# EasyEDA Pro project USB Hub PCB.epro

# Schematic Schematic1
Board Name: Board1; Create Date: 2026-05-19; Page Name: P1; Project Name: USB Hub; Schematic Name: Schematic1; Update Date: 2026-05-19; Company: EasyEDA.com; Page Size: A4; Version: V1.0
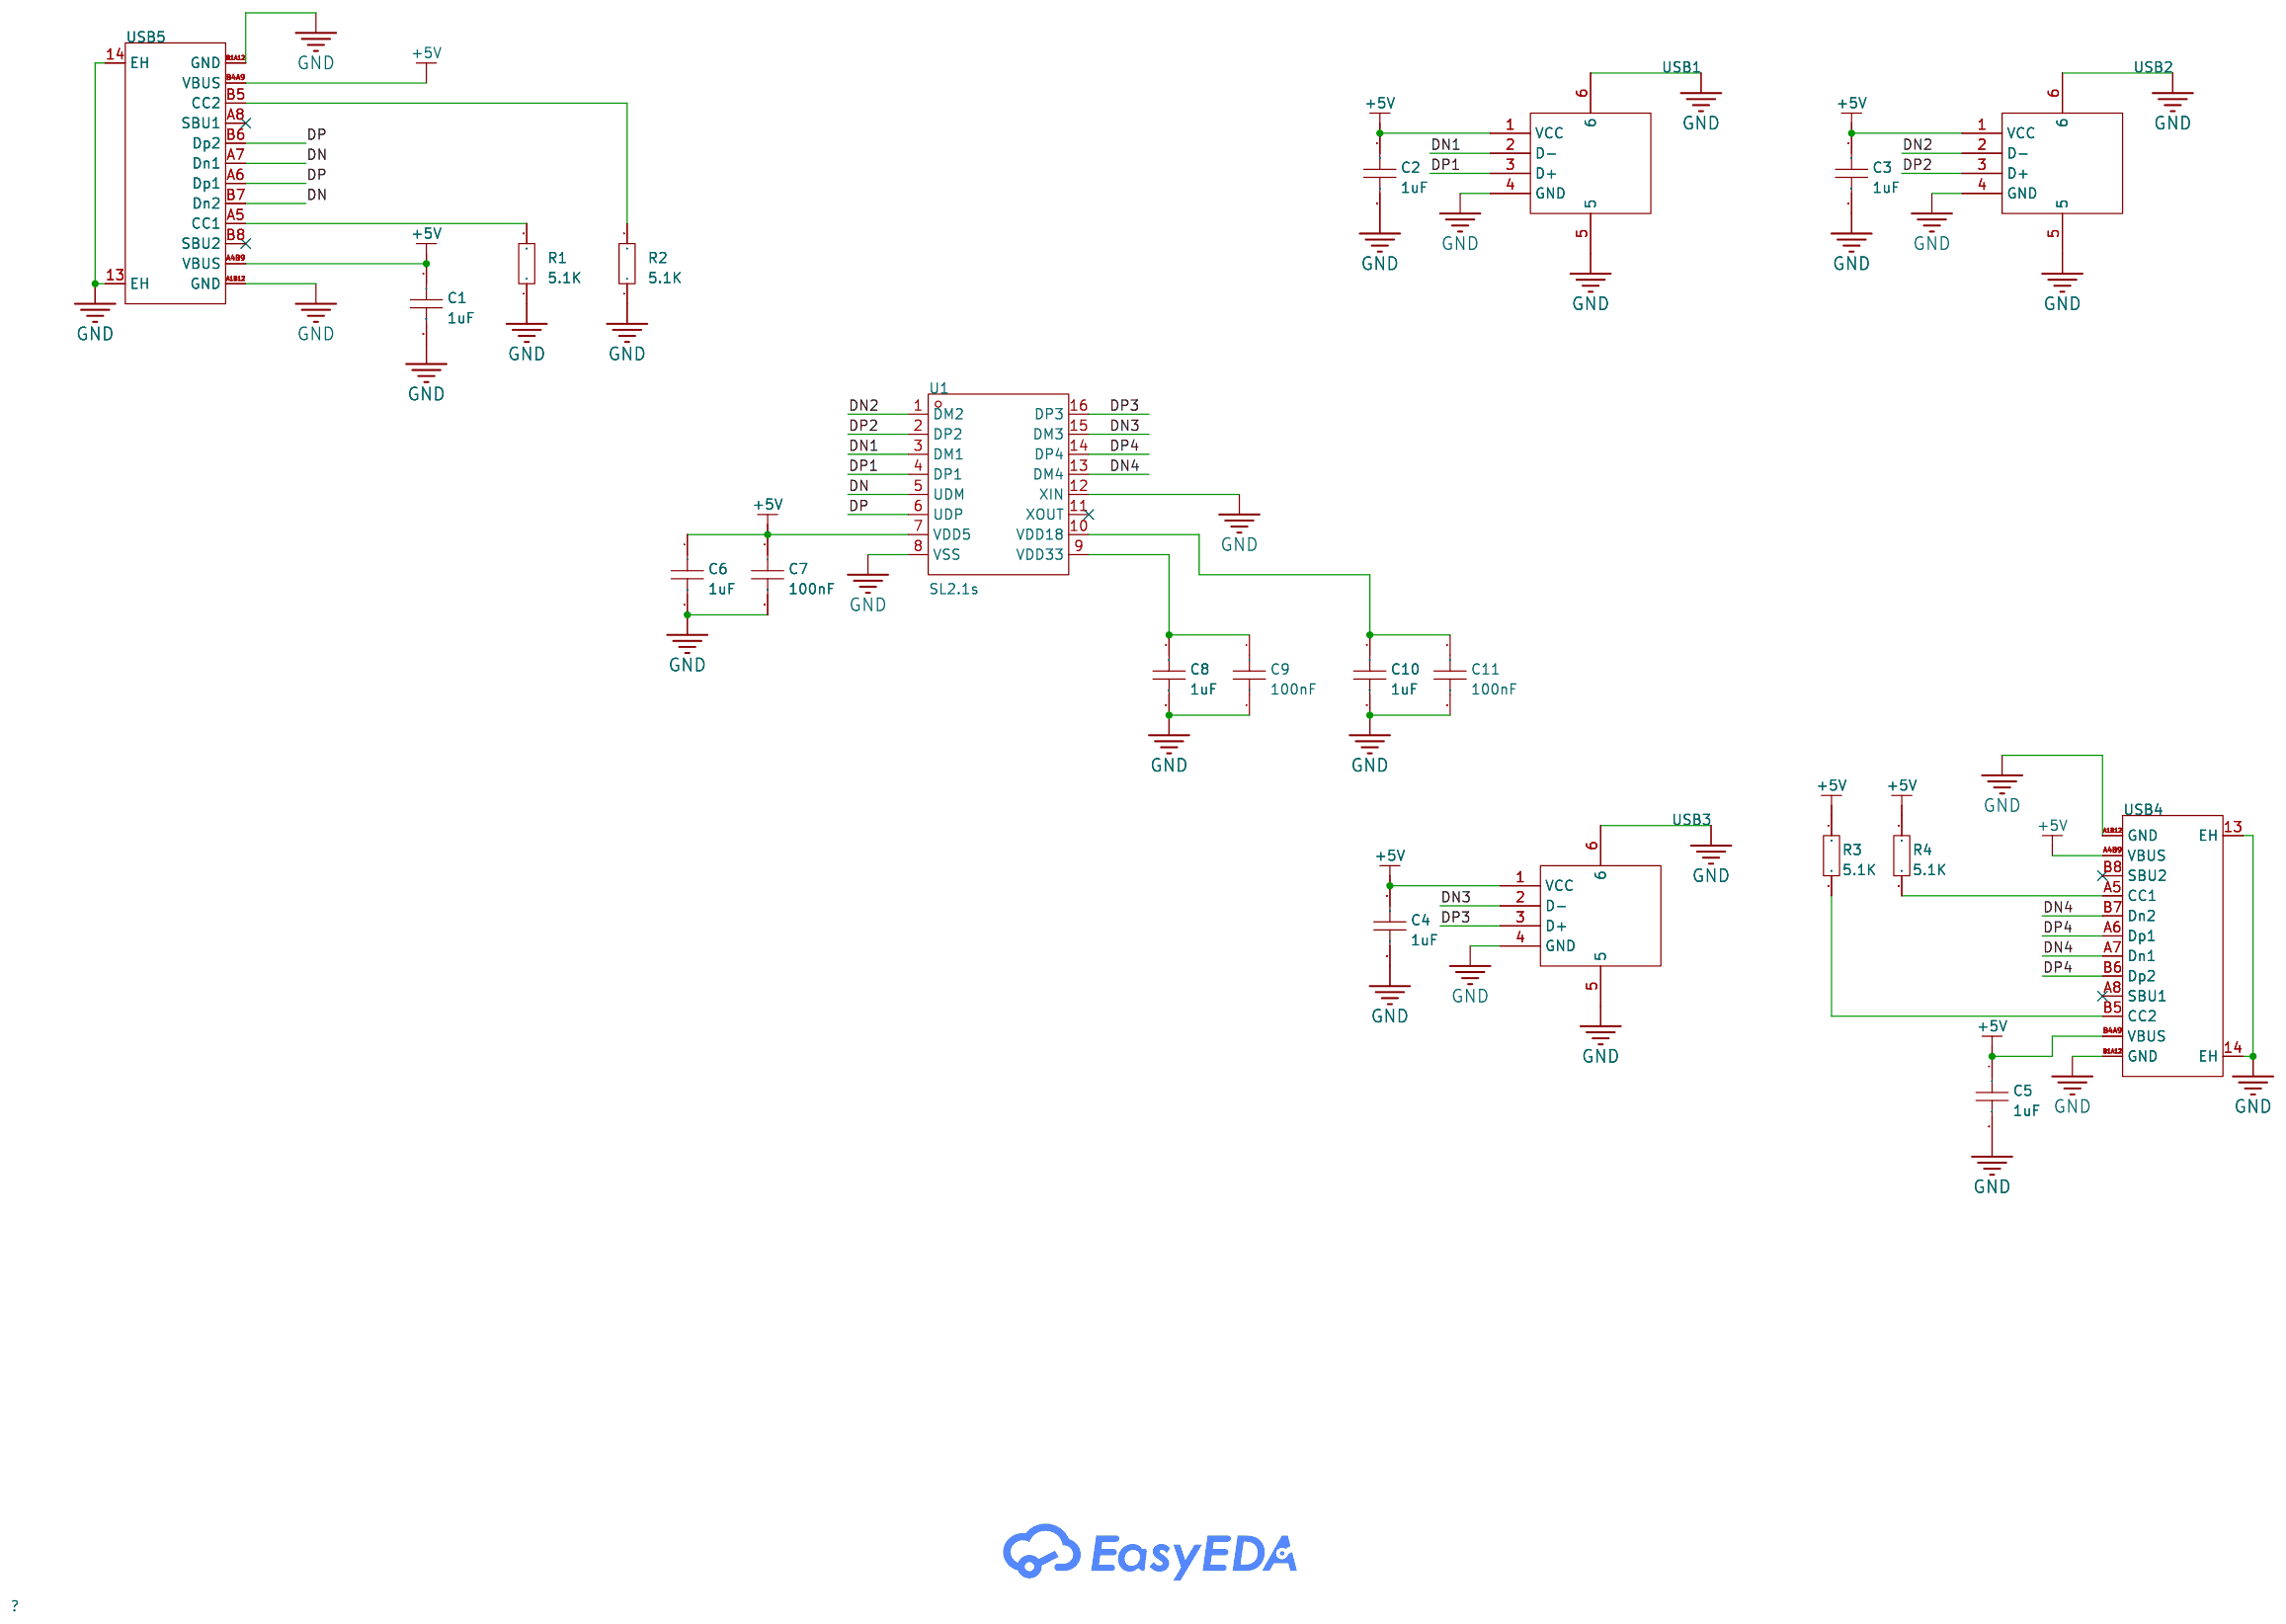
[diagram p0: schematic sheet]

## Parts
C1  1uF  [C0603]
C2  1uF  [C0603]
C3  1uF  [C0603]
C4  1uF  [C0603]
C5  1uF  [C0603]
C6  1uF  [C0603]
C7  100nF  [C0603]
C8  1uF  [C0603]
C9  100nF  [C0603]
C10  1uF  [C0603]
C11  100nF  [C0603]
R1  5.1K  [R0603]
R2  5.1K  [R0603]
R3  5.1K  [R0603]
R4  5.1K  [R0603]
U1  SL2.1s  [SSOP-16_L4.6-W2.6-P0.53-LS4.0-BL]
USB1  10.0 QHHTZB6.3  [USB-A-TH_10.0QHHTZB6.3]
USB2  10.0 QHHTZB6.3  [USB-A-TH_10.0QHHTZB6.3]
USB3  10.0 QHHTZB6.3  [USB-A-TH_10.0QHHTZB6.3]
USB4  TYPE-C 16PIN 2MD(073)  [USB-C-SMD_TYPE-C-16PIN-2MD-073]
USB5  TYPE-C 16PIN 2MD(073)  [USB-C-SMD_TYPE-C-16PIN-2MD-073]

## Library data of the parts
C1-C11 = CAP_0603: Supplier Footprint: 0603
R1-R4 = Res_0603: Supplier Footprint: 0603
U1 = SL2.1s: type:Hub USB Protocol:USB 2.0 Data Rate:- Voltage - Supply:4V~5.25V Voltage - Supply:4V~5.25V Operating Temperature:0℃~+70℃ Operating Temperature:0℃~+70℃ Memory Interface:- Current - Supply:120mA Quiescent Supply Current:2.5mA Number of Channels:4; LCSC Part Name: USB2.0 HUB控制器集成电路; Supplier Part: C2684433; Manufacturer: CoreChips(和芯润德); Supplier Footprint: SSOP-16; JLCPCB Part Class: Extended Part; Datasheet: https://item.szlcsc.com/datasheet/SL2.1s/2782346.html; Supplier: LCSC; type: Hub; USB Protocol: USB 2.0; Voltage - Supply: 4V~5.25V; Operating Temperature: 0℃~+70℃; Current - Supply: 120mA; Quiescent Supply Current: 2.5mA; Number of Channels: 4
USB1-USB3 = 10.0 QHHTZB6.3: Connector Type:Type-A Protocol Standard:USB 2.0 Gender:Female Mounting Type:Surface Mount, Right Angle Number of Contacts:4P Number of Ports:1 Current Rating-Power:1.5A Voltage Rating:30V Connect-Disconnect Life:5,000 times Supplementary Features:- Center; LCSC Part Name: 壳长10.0mm; Supplier Part: C668591; Manufacturer: SHOU HAN(首韩); Supplier Footprint: SMD; JLCPCB Part Class: Extended Part; Datasheet: https://item.szlcsc.com/datasheet/10.0%2520QHHTZB6.3/698534.html; Supplier: LCSC; Connector Type: Type-A; Protocol Standard: USB 2.0; Gender: Female; Mounting Type: Surface Mount, Right Angle; Number of Contacts: 4P; Number of Ports: 1; Current Rating-Power: 1.5A; Voltage Rating: 30V; Connect-Disconnect Life: 5,000 times; Length: 10mm; Detection color: Black; Operating Temperature: -25℃~+85℃
USB4 USB5 = TYPE-C 16PIN 2MD(073): Connector Type:Type-C Protocol Standard:- Gender:Female Mounting Type:Surface Mount, Right Angle Number of Contacts:16P Number of Ports:1 Current Rating-Power:3A Voltage Rating:5V Connect-Disconnect Life:10,000 Cycles Supplementary Features:- Center Heigh; LCSC Part Name: Type-C 母 卧贴; Supplier Part: C2765186; Manufacturer: SHOU HAN(首韩); Supplier Footprint: SMD; JLCPCB Part Class: Extended Part; Datasheet: https://item.szlcsc.com/datasheet/TYPE-C%252016PIN%25202MD(073)/2901843.html; Supplier: LCSC; Connector Type: Type-C; Gender: Female; Mounting Type: Surface Mount, Right Angle; Number of Contacts: 16P; Number of Ports: 1; Current Rating-Power: 3A; Voltage Rating: 5V; Connect-Disconnect Life: 10,000 Cycles; Detection color: Black; Operating Temperature: -25℃~+85℃

## Nets
+5V: C1.1 C2.1 C3.1 C4.1 C5.1 C6.1 C7.1 R3.1 R4.1 U1.7(VDD5) USB1.1(VCC) USB2.1(VCC) USB3.1(VCC) USB4.A4B9(VBUS) USB4.B4A9(VBUS) USB5.A4B9(VBUS) USB5.B4A9(VBUS)
GND: C1.2 C2.2 C3.2 C4.2 C5.2 C6.2 C7.2 C8.2 C9.2 C10.2 C11.2 R1.1 R2.1 U1.8(VSS) U1.12(XIN) USB1.4(GND) USB1.5 USB1.6 USB2.4(GND) USB2.5 USB2.6 USB3.4(GND) USB3.5 USB3.6 USB4.13(EH) USB4.14(EH) USB4.A1B12(GND) USB4.B1A12(GND) USB5.13(EH) USB5.14(EH) USB5.A1B12(GND) USB5.B1A12(GND)
DN: U1.5(UDM) USB5.A7(Dn1) USB5.B7(Dn2)
DN1: U1.3(DM1) USB1.2(D-)
DN2: U1.1(DM2) USB2.2(D-)
DN3: U1.15(DM3) USB3.2(D-)
DN4: U1.13(DM4) USB4.A7(Dn1) USB4.B7(Dn2)
DP: U1.6(UDP) USB5.A6(Dp1) USB5.B6(Dp2)
DP1: U1.4(DP1) USB1.3(D+)
DP2: U1.2(DP2) USB2.3(D+)
DP3: U1.16(DP3) USB3.3(D+)
DP4: U1.14(DP4) USB4.A6(Dp1) USB4.B6(Dp2)
$1N939: R1.2 USB5.A5(CC1)
$1N943: R2.2 USB5.B5(CC2)
$1N1533: R4.2 USB4.A5(CC1)
$1N1537: R3.2 USB4.B5(CC2)
$1N2153: C8.1 C9.1 U1.9(VDD33)
$1N2172: C10.1 C11.1 U1.10(VDD18)

Not connected (* = marked no-connect by the designer): U1 11(XOUT)*; USB4 A8(SBU1)* B8(SBU2)*; USB5 A8(SBU1)* B8(SBU2)*

# Board PCB1
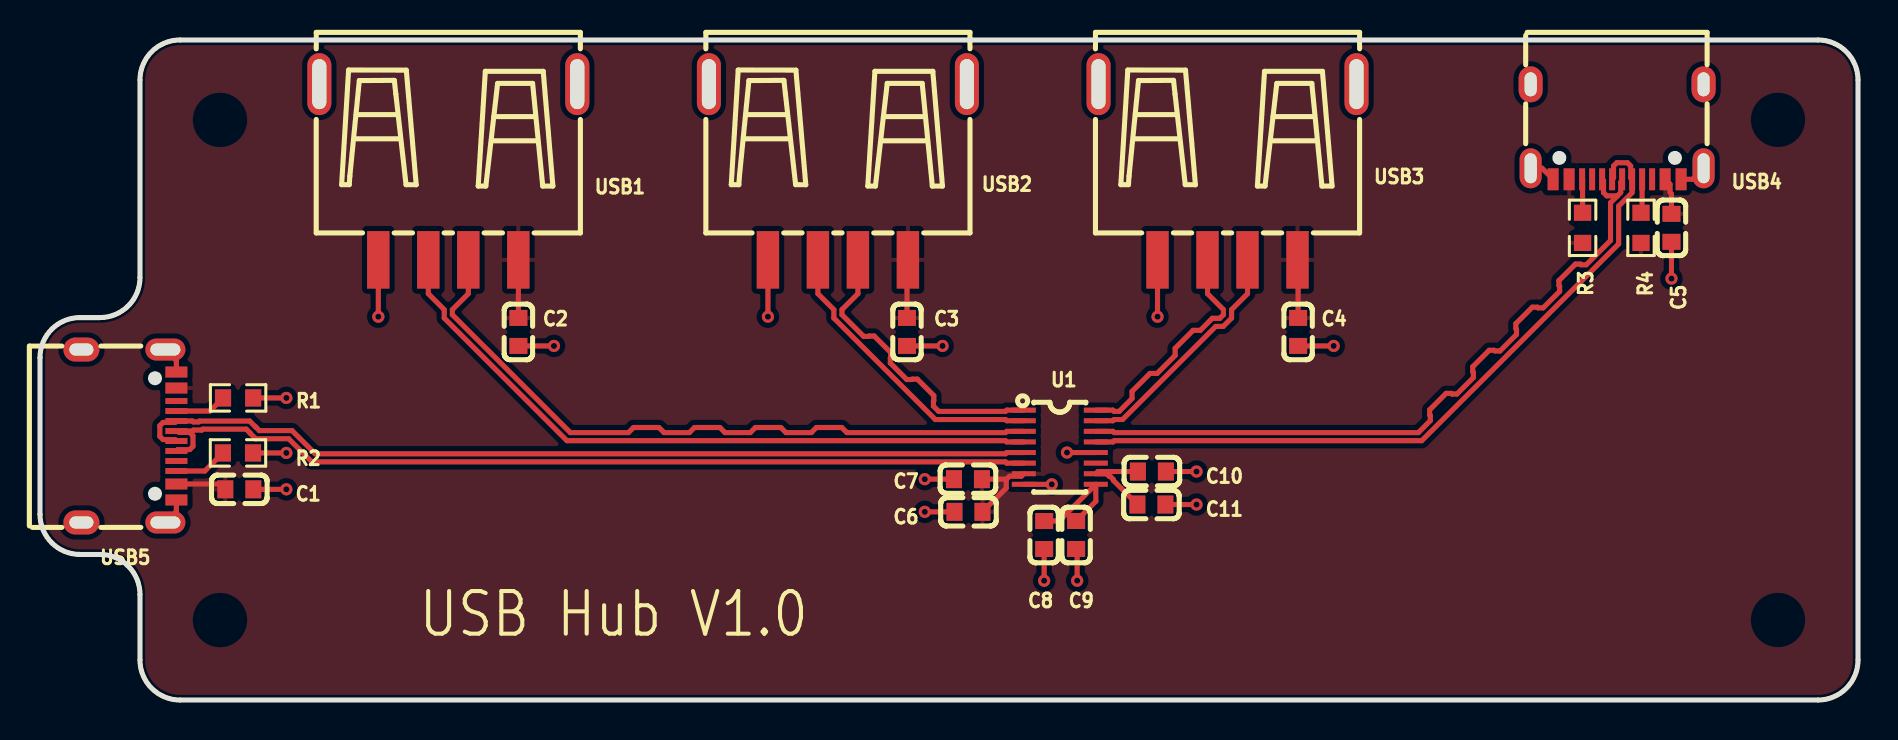
[diagram p1: board, top side]
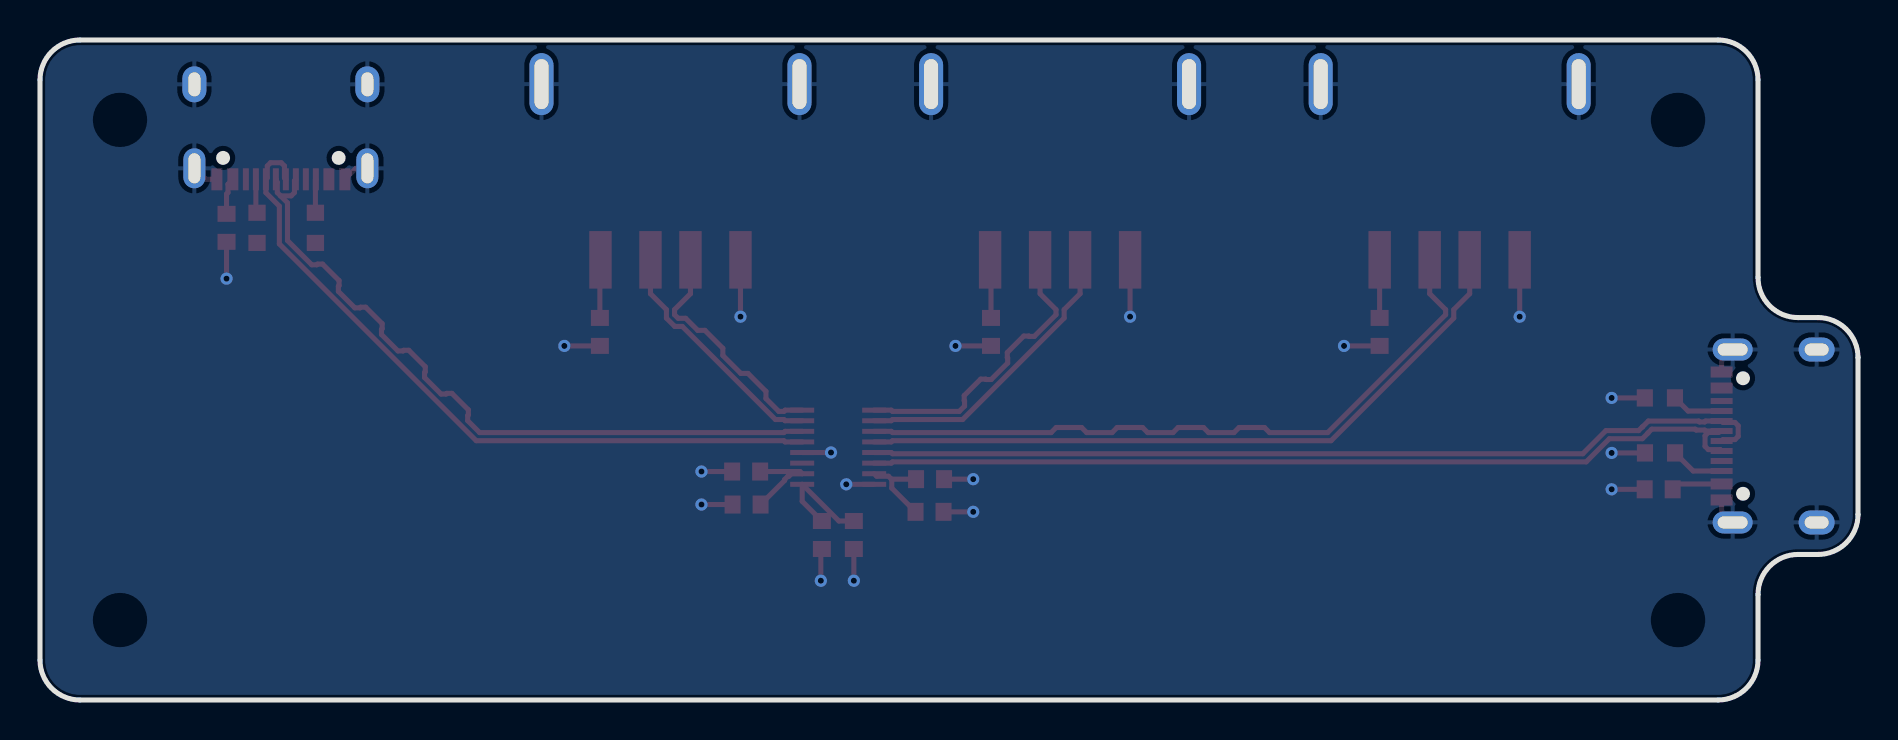
[diagram p2: board, bottom side, seen from below]

Outline 90.91 x 33.02 mm; copper layers: Top Layer, Bottom Layer. Coordinates in mm from the lower left corner of the outline.
Outline path: 0,17.13 0,9.28 arc(0.59,7.87) 2,7.28 3,7.28 arc(4.41,6.7) 5,5.28 5,2 arc(5.59,0.59) 7,0 88.91,0 arc(90.32,0.59) 90.91,2 90.91,31.02 arc(90.32,32.43) 88.91,33.02 7,33.02 arc(5.59,32.43) 5,31.02 5,21.13 arc(4.41,19.72) 3,19.13 2,19.13 arc(0.59,18.55) 0,17.13
Stack: Top Layer 0.035mm / Dielectric1 1.51mm FR4 er 4.5 / Bottom Layer 0.035mm

## Design rules (mm)
net DN2: DP3
net DP2: DP3
net DN1: DP4
net DP1: DP4
net DN: DP5
net DP: DP5
net DN4: DP1
net DP4: DP1
net DN3: DP2
net DP3: DP2
template: JLCPCB Capability(Two Layers Board)
spacing copperThickness1oz (default): track to track 0.102, other pairs 0.152 to 0.3
spacing copperThickness2oz: track to track 0.203, other pairs 0.152 to 0.3
track width copperThickness1oz (default): min 0.127, default 0.254, max 2.54
track width copperThickness2oz: min 0.203, default 0.254, max 2.54
differential pair differentialPair (default): width min 0.127, default 0.254, max 2.54; gap min 0.152, default 0.152
via viaSize (default): diameter min 0.5, default 0.61, max 10; hole min 0.3, default 0.305, max 6.3

## Placement (name value [footprint] x y rotation side)
C1  1uF  [C0603]  9.97 10.54 0 top
C2  1uF  [C0603]  23.92 18.41 270 top
C3  1uF  [C0603]  43.35 18.41 270 top
C4  1uF  [C0603]  62.91 18.41 270 top
C5  1uF  [C0603]  81.58 23.62 270 top
C6  1uF  [C0603]  46.43 9.41 180 top
C7  100nF  [C0603]  46.4 11.05 180 top
C8  1uF  [C0603]  50.21 8.25 270 top
C9  100nF  [C0603]  51.81 8.26 270 top
C10  1uF  [C0603]  55.6 11.43 0 top
C11  100nF  [C0603]  55.58 9.78 0 top
R1  5.1K  [R0603]  9.91 15.11 180 top
R2  5.1K  [R0603]  9.9 12.36 180 top
R3  5.1K  [R0603]  77.14 23.62 90 top
R4  5.1K  [R0603]  80.06 23.62 90 top
U1  SL2.1s  [SSOP-16_L4.6-W2.6-P0.53-LS4.0-BL]  51 12.65 270 top
USB1  10.0 QHHTZB6.3  [USB-A-TH_10.0QHHTZB6.3]  20.42 26.42 180 top
USB2  10.0 QHHTZB6.3  [USB-A-TH_10.0QHHTZB6.3]  39.9 26.42 180 top
USB3  10.0 QHHTZB6.3  [USB-A-TH_10.0QHHTZB6.3]  59.38 26.42 180 top
USB4  TYPE-C 16PIN 2MD(073)  [USB-C-SMD_TYPE-C-16PIN-2MD-073]  78.86 28.43 180 top
USB5  TYPE-C 16PIN 2MD(073)  [USB-C-SMD_TYPE-C-16PIN-2MD-073]  4.44 13.21 270 top

## Footprints (pads in the part's own frame, mm; a bottom-side part is the same pattern mirrored in y, then rotated)
C0603
  rect 0.8x0.9 smd: 1(-0.7,0) 2(0.7,0)
R0603
  rect 0.806x0.864 smd: 1(-0.753,0) 2(0.753,0)
SSOP-16_L4.6-W2.6-P0.53-LS4.0-BL
  rect 0.25x1.2 smd: 1(-1.855,-1.8) 2(-1.325,-1.8) 3(-0.795,-1.8) 4(-0.265,-1.8) 5(0.265,-1.8) 6(0.795,-1.8) 7(1.325,-1.8) 8(1.855,-1.8) 9(1.855,1.8) 10(1.325,1.8) 11(0.795,1.8) 12(0.265,1.8) 13(-0.265,1.8) 14(-0.795,1.8) 15(-1.325,1.8) 16(-1.855,1.8)
USB-A-TH_10.0QHHTZB6.3
  rect 1.12x2.88 smd: 1(-3.5,4.395) 2(-1,4.395) 3(1,4.395) 4(3.5,4.395)
  oval 1.2x3.1 hole 0.7x2.5: 5(-6.45,-4.395) 6(6.45,-4.395)
USB-C-SMD_TYPE-C-16PIN-2MD-073
  oval 1.1x2 hole 0.6x1.5: 13(-4.325,1.825) 14(4.325,1.825)
  oval 1.2x1.8 hole 0.6x1.2: 13(-4.325,-2.375) 14(4.325,-2.375)
  rect 0.55x1.1 smd: A1B12(-3.2,2.375) A4B9(-2.4,2.375) B1A12(3.2,2.375) B4A9(2.4,2.375)
  rect 0.3x1.1 smd: A5(-1.25,2.375) A6(-0.25,2.375) A7(0.25,2.375) A8(1.25,2.375) B5(1.75,2.375) B6(0.75,2.375) B7(-0.75,2.375) B8(-1.75,2.375)

## Nets
As in the schematic.

Pads without a net: U1 11; USB4 A8 B8; USB5 A8 B8

## Via types
v1: diameter 0.61, hole 0.305, Top Layer to Bottom Layer, 18 vias

## Routing (per net, layer and track width the routed paths; a pad name or vN(x,y) marks a point on that pad's centre or on a via; arc(x,y) is an arc through that point)
+5V: length 17.5
  Top Layer w0.254: 48.33,11.05 48.48,11.19 49.07,11.19 49.19,11.32 ; 48.33,11.05 48.32,11.03 48.32,10.6 C6.1 ; 48.33,11.05 C7.1 ; 81.26,26.05 81.51,25.8 81.51,25.38 81.58,25.31 C5.1 ; USB1.1 23.92,22.02 C2.1 ; C3.1 43.35,21.97 USB2.1 ; C4.1 62.91,21.99 USB3.1 ; C1.1 9,10.81 USB5.B4A9
GND: length 38.2
  Top Layer w0.254: USB4.14 75.11,26.6 USB4.B1A12 ; C6.2 v1(44.24,9.41) ; C10.2 v1(57.83,11.43) ; C3.2 v1(45.13,17.71) ; C1.2 v1(12.32,10.54) ; U1.12 v1(51.35,12.38) ; R1.1 v1(12.32,15.11) ; 50.21,7.55 v1(50.21,5.97) ; USB5.13 6.82,16.98 USB5.A1B12 ; C4.2 v1(64.69,17.71) ; C5.2 v1(81.58,21.08) ; USB2.4 v1(36.4,19.18) ; USB4.13 82.64,26.05 USB4.A1B12 ; USB3.4 v1(55.88,19.18) ; USB1.4 v1(16.92,19.18) ; C2.2 v1(25.7,17.71) ; 49.19,10.79 v1(50.59,10.79) ; C11.2 v1(57.83,9.78) ; C7.2 v1(44.24,11.05) ; USB5.B1A12 6.82,9.43 USB5.14 ; v1(51.86,5.97) 51.86,7.5 C9.2 ; R2.1 v1(12.32,12.36)
DN: length 45.5
  Top Layer w0.254: USB5.A7 6.75,13.03 6.15,13.03 5.99,13.19 5.99,13.72 6.15,13.89 6.75,13.89 USB5.B7 7.62,13.96 7.67,13.91 7.92,13.91 7.97,13.96 10.48,13.96 10.78,13.66 10.79,13.66 10.97,13.48 12.6,13.48 13.76,12.32 48.28,12.32 48.34,12.38 49.19,12.38
DN1: length 35
  Top Layer w0.254: USB1.2 21.42,20.33 20.62,19.53 20.62,19.28 26.52,13.38 29.43,13.38 29.68,13.63 30.95,13.63 31.2,13.38 32.47,13.38 32.73,13.63 34,13.63 34.25,13.38 35.52,13.38 35.78,13.63 37.05,13.63 37.3,13.38 38.57,13.38 38.82,13.63 40.09,13.63 40.35,13.38 48.28,13.38 48.34,13.44 49.19,13.44
DN2: length 14.9
  Top Layer w0.254: USB2.2 40.9,20.33 40.1,19.53 40.1,19.28 41.19,18.19 41.44,18.19 41.46,18.21 41.72,18.21 42.54,17.38 42.54,17.13 42.52,17.11 42.52,16.86 43.34,16.03 43.6,16.03 43.62,16.05 43.87,16.05 44.69,15.23 44.69,14.98 44.68,14.96 44.68,14.7 44.94,14.44 48.28,14.44 48.34,14.5 49.19,14.5
DN3: length 12.2
  Top Layer w0.254: U1.15 53.65,13.97 53.71,14.03 54.13,14.03 58.79,18.69 59.17,18.69 59.58,19.11 59.58,19.53 60.38,20.33 USB3.2
DN4: length 36.1
  Top Layer w0.254: U1.13 53.65,12.91 53.71,12.97 69.09,12.97 78.94,22.82 78.94,24.71 79.61,25.38 USB4.B7 79.54,26.12 79.54,26.72 79.38,26.88 78.85,26.88 78.68,26.72 78.68,26.12 USB4.A7
DP: length 45.5
  Top Layer w0.254: 49.19,11.85 48.34,11.85 48.28,11.91 13.59,11.91 12.43,13.07 10.78,13.07 10.5,13.35 10.5,13.36 10.31,13.55 8.14,13.55 8.09,13.5 7.67,13.5 7.62,13.46 USB5.A6 6.84,13.44 6.92,13.44 6.97,13.39 7.48,13.39 7.65,13.22 7.65,12.69 7.48,12.53 6.89,12.53 USB5.B6
DP1: length 34.8
  Top Layer w0.254: USB1.3 19.42,20.33 20.21,19.53 20.21,19.11 26.35,12.97 48.28,12.97 48.34,12.91 49.19,12.91
DP2: length 14.9
  Top Layer w0.254: 49.19,13.97 48.34,13.97 48.28,14.03 44.77,14.03 39.7,19.11 39.7,19.53 38.9,20.33 USB2.3
DP3: length 11.9
  Top Layer w0.254: U1.16 53.65,14.5 53.71,14.44 53.97,14.44 54.61,15.08 54.61,15.44 55.51,16.34 55.86,16.34 56.76,17.24 56.76,17.6 57.66,18.49 58.02,18.49 58.62,19.1 59,19.1 59.18,19.28 59.18,19.53 58.38,20.33 USB3.3
DP4: length 36.1
  Top Layer w0.254: USB4.A6 79.09,26.03 79.09,25.95 79.04,25.9 79.04,25.38 78.88,25.22 ; 78.88,25.22 78.35,25.22 78.18,25.38 78.18,25.98 USB4.B6 ; 78.88,25.22 78.53,24.88 78.53,22.99 77.32,21.77 77.07,21.77 77.03,21.81 76.78,21.81 75.95,20.98 75.95,20.73 75.99,20.7 75.99,20.44 75.16,19.62 74.91,19.62 74.88,19.65 74.62,19.65 73.8,18.83 73.8,18.57 73.83,18.54 73.83,18.29 73.01,17.46 72.75,17.46 72.72,17.5 72.47,17.5 71.64,16.67 71.64,16.42 71.68,16.38 71.68,16.13 70.85,15.31 70.6,15.31 70.57,15.34 70.31,15.34 69.49,14.52 69.49,14.26 69.52,14.23 69.52,13.98 68.93,13.38 53.71,13.38 53.65,13.44 U1.14
$1N939: length 2.6
  Top Layer w0.254: R1.2 8.5,14.46 USB5.A5
$1N943: length 2.7
  Top Layer w0.254: USB5.B5 8.24,11.46 R2.2
$1N1533: length 1.7
  Top Layer w0.254: R4.2 80.11,24.43 USB4.A5
$1N1537: length 1.7
  Top Layer w0.254: USB4.B5 77.14,26.03 R3.2
$1N2153: length 5.6
  Top Layer w0.254: C8.1 50.96,8.95 U1.9 52.79,9.94 C9.1
$1N2172: length 4.9
  Top Layer w0.254: C11.1 53.67,10.98 53.67,11.03 53.51,11.19 53.46,11.19 53.34,11.32 U1.10 52.91,11.43 C10.1

## Copper pours and planes (outline as drawn; the poured copper is in the pictures)
+5V on Top Layer: -1.1,38.48 95.3,38.48 95.3,-4.06 -1.1,-4.06
GND on Bottom Layer: -0.46,38.61 95.3,38.61 95.3,-4.06 -0.46,-4.06

## Text on the board
Top Silkscreen Layer: USB Hub V1.0
